# EAGLE design untitled 6 (EAGLE 7.5.0)
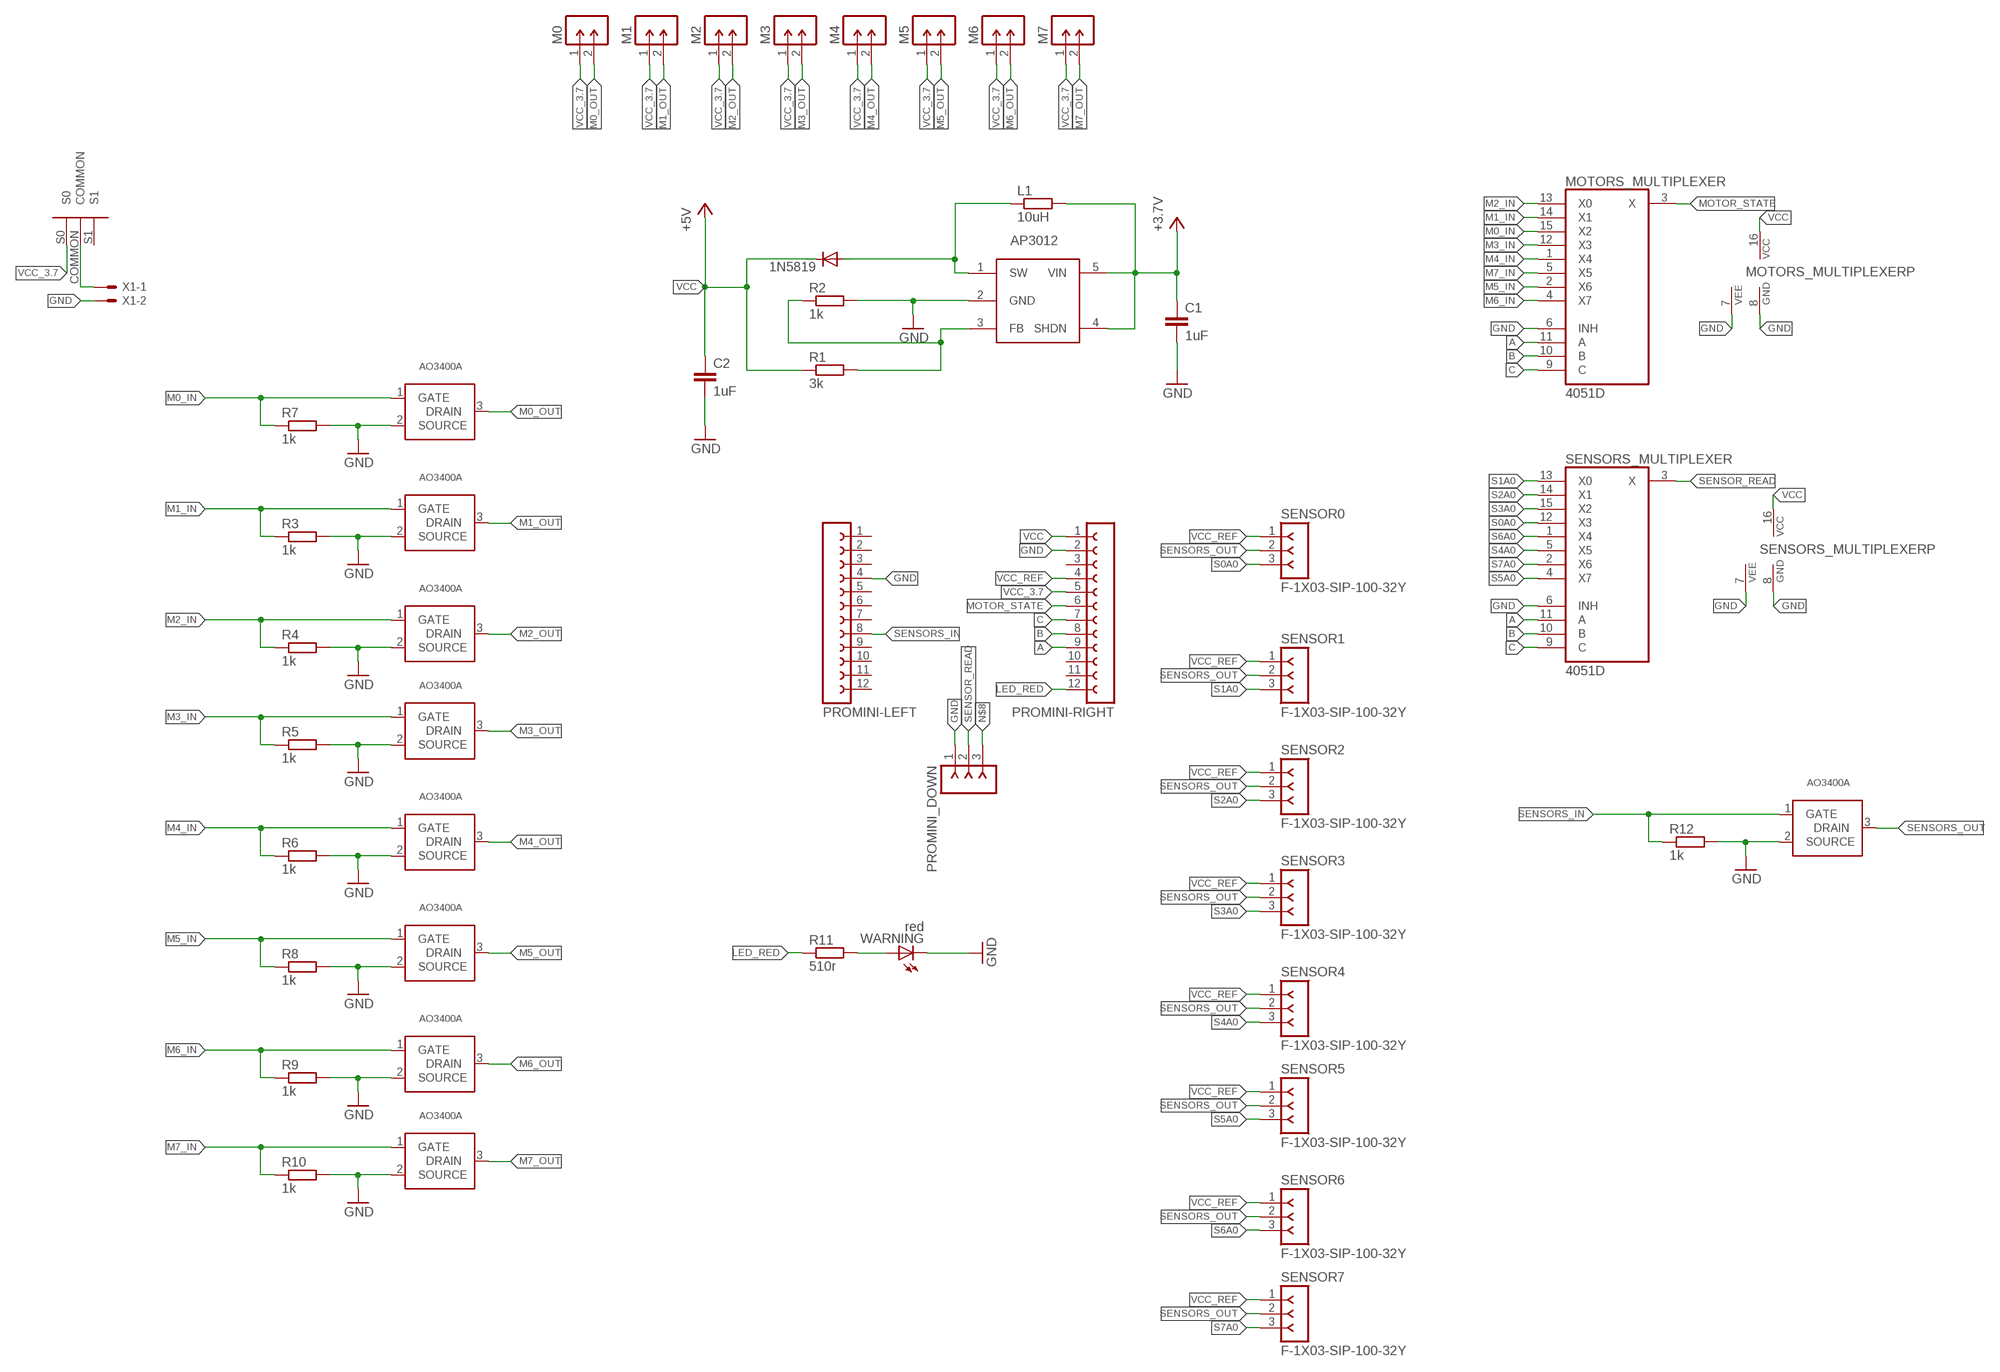
[diagram p0: schematic, sheet 1]

## Parts
1N5819  DIODE-DO214AC  [DO214AC]
C1  1uF  C-EUC1206  [C1206]
C2  1uF  C-EUC1206  [C1206]
L1  10uH  R-EU_R0805  [R0805]
M0  M-1X02-SIP-100-32Y  [SIP-100-02-32Y]
M1  M-1X02-SIP-100-32Y  [SIP-100-02-32Y]
M2  M-1X02-SIP-100-32Y  [SIP-100-02-32Y]
M3  M-1X02-SIP-100-32Y  [SIP-100-02-32Y]
M4  M-1X02-SIP-100-32Y  [SIP-100-02-32Y]
M5  M-1X02-SIP-100-32Y  [SIP-100-02-32Y]
M6  M-1X02-SIP-100-32Y  [SIP-100-02-32Y]
M7  M-1X02-SIP-100-32Y  [SIP-100-02-32Y]
MOSFET0  AO3400A  [SOT-23]
MOSFET1  AO3400A  [SOT-23]
MOSFET2  AO3400A  [SOT-23]
MOSFET3  AO3400A  [SOT-23]
MOSFET4  AO3400A  [SOT-23]
MOSFET5  AO3400A  [SOT-23]
MOSFET6  AO3400A  [SOT-23]
MOSFET7  AO3400A  [SOT-23]
MOSFET8  AO3400A  [SOT-23]
MOTORS_MULTIPLEXER  4051D  [SO16]
PROMINI-LEFT  FE12-1  [FE12]
PROMINI-RIGHT  FE12-1  [FE12]
PROMINI_DOWN  F-1X03-SIP-100-32Y  [SIP-100-03-32Y]
R1  3k  R-EU_R1206  [R1206]
R2  1k  R-EU_R1206  [R1206]
R3  1k  R-EU_R1206  [R1206]
R4  1k  R-EU_R1206  [R1206]
R5  1k  R-EU_R1206  [R1206]
R6  1k  R-EU_R1206  [R1206]
R7  1k  R-EU_R1206  [R1206]
R8  1k  R-EU_R1206  [R1206]
R9  1k  R-EU_R1206  [R1206]
R10  1k  R-EU_R1206  [R1206]
R11  510r  R-EU_M0805  [M0805]
R12  1k  R-EU_R1206  [R1206]
SENSOR0  F-1X03-SIP-100-32Y  [SIP-100-03-32Y]
SENSOR1  F-1X03-SIP-100-32Y  [SIP-100-03-32Y]
SENSOR2  F-1X03-SIP-100-32Y  [SIP-100-03-32Y]
SENSOR3  F-1X03-SIP-100-32Y  [SIP-100-03-32Y]
SENSOR4  F-1X03-SIP-100-32Y  [SIP-100-03-32Y]
SENSOR5  F-1X03-SIP-100-32Y  [SIP-100-03-32Y]
SENSOR6  F-1X03-SIP-100-32Y  [SIP-100-03-32Y]
SENSOR7  F-1X03-SIP-100-32Y  [SIP-100-03-32Y]
SENSORS_MULTIPLEXER  4051D  [SO16]
U$1  AP3012  [SOT-23-5]
U$2  SPDT_SLIDE_SWITCH_2_PITCH  [SPDT_SLIDE_SWITCH_2_PITCH]
WARNING  red  LEDCHIP-LED0805  [CHIP-LED0805]
X1  JST-XH-02-PIN-LONG-PAD  [JST-XH-02-PACKAGE-LONG-PAD]

## Nets
A: MOTORS_MULTIPLEXER.11(A) PROMINI-RIGHT.9 SENSORS_MULTIPLEXER.11(A)
B: MOTORS_MULTIPLEXER.10(B) PROMINI-RIGHT.8 SENSORS_MULTIPLEXER.10(B)
C: MOTORS_MULTIPLEXER.9(C) PROMINI-RIGHT.7 SENSORS_MULTIPLEXER.9(C)
GND: C1.2 C2.2 MOSFET0.2(SOURCE) MOSFET1.2(SOURCE) MOSFET2.2(SOURCE) MOSFET3.2(SOURCE) MOSFET4.2(SOURCE) MOSFET5.2(SOURCE) MOSFET6.2(SOURCE) MOSFET7.2(SOURCE) MOSFET8.2(SOURCE) MOTORS_MULTIPLEXER.6(INH) MOTORS_MULTIPLEXER.7(VEE) MOTORS_MULTIPLEXER.8(GND) PROMINI-LEFT.4 PROMINI-RIGHT.2 PROMINI_DOWN.1 R2.2 R3.2 R4.2 R5.2 R6.2 R7.2 R8.2 R9.2 R10.2 R12.2 SENSORS_MULTIPLEXER.6(INH) SENSORS_MULTIPLEXER.7(VEE) SENSORS_MULTIPLEXER.8(GND) U$1.2(GND) WARNING.C X1.2
LED_RED: PROMINI-RIGHT.12 R11.1
M0_IN: MOSFET0.1(GATE) MOTORS_MULTIPLEXER.15(X2) R7.1
M0_OUT: M0.2 MOSFET0.3(DRAIN)
M1_IN: MOSFET1.1(GATE) MOTORS_MULTIPLEXER.14(X1) R3.1
M1_OUT: M1.2 MOSFET1.3(DRAIN)
M2_IN: MOSFET2.1(GATE) MOTORS_MULTIPLEXER.13(X0) R4.1
M2_OUT: M2.2 MOSFET2.3(DRAIN)
M3_IN: MOSFET3.1(GATE) MOTORS_MULTIPLEXER.12(X3) R5.1
M3_OUT: M3.2 MOSFET3.3(DRAIN)
M4_IN: MOSFET4.1(GATE) MOTORS_MULTIPLEXER.1(X4) R6.1
M4_OUT: M4.2 MOSFET4.3(DRAIN)
M5_IN: MOSFET5.1(GATE) MOTORS_MULTIPLEXER.2(X6) R8.1
M5_OUT: M5.2 MOSFET5.3(DRAIN)
M6_IN: MOSFET6.1(GATE) MOTORS_MULTIPLEXER.4(X7) R9.1
M6_OUT: M6.2 MOSFET6.3(DRAIN)
M7_IN: MOSFET7.1(GATE) MOTORS_MULTIPLEXER.5(X5) R10.1
M7_OUT: M7.2 MOSFET7.3(DRAIN)
MOTOR_STATE: MOTORS_MULTIPLEXER.3(X) PROMINI-RIGHT.6
N$1: 1N5819.A L1.1 U$1.1(SW)
N$3: R1.2 R2.1 U$1.3(FB)
N$4: R11.2 WARNING.A
N$5: U$2.COMMON X1.1
N$8: PROMINI_DOWN.3
S0A0: SENSOR0.3 SENSORS_MULTIPLEXER.12(X3)
S1A0: SENSOR1.3 SENSORS_MULTIPLEXER.13(X0)
S2A0: SENSOR2.3 SENSORS_MULTIPLEXER.14(X1)
S3A0: SENSOR3.3 SENSORS_MULTIPLEXER.15(X2)
S4A0: SENSOR4.3 SENSORS_MULTIPLEXER.5(X5)
S5A0: SENSOR5.3 SENSORS_MULTIPLEXER.4(X7)
S6A0: SENSOR6.3 SENSORS_MULTIPLEXER.1(X4)
S7A0: SENSOR7.3 SENSORS_MULTIPLEXER.2(X6)
SENSOR_READ: PROMINI_DOWN.2 SENSORS_MULTIPLEXER.3(X)
SENSORS_IN: MOSFET8.1(GATE) PROMINI-LEFT.8 R12.1
SENSORS_OUT: MOSFET8.3(DRAIN) SENSOR0.2 SENSOR1.2 SENSOR2.2 SENSOR3.2 SENSOR4.2 SENSOR5.2 SENSOR6.2 SENSOR7.2
VCC: 1N5819.C C2.1 MOTORS_MULTIPLEXER.16(VCC) PROMINI-RIGHT.1 R1.1 SENSORS_MULTIPLEXER.16(VCC) ; supply symbol labelled +5V
VCC_3.7: C1.1 L1.2 M0.1 M1.1 M2.1 M3.1 M4.1 M5.1 M6.1 M7.1 PROMINI-RIGHT.5 U$1.4(SHDN) U$1.5(VIN) U$2.S0 ; supply symbol labelled +3.7V
VCC_REF: PROMINI-RIGHT.4 SENSOR0.1 SENSOR1.1 SENSOR2.1 SENSOR3.1 SENSOR4.1 SENSOR5.1 SENSOR6.1 SENSOR7.1
Unconnected: PROMINI-LEFT.1 PROMINI-LEFT.2 PROMINI-LEFT.3 PROMINI-LEFT.5 PROMINI-LEFT.6 PROMINI-LEFT.7 PROMINI-LEFT.9 PROMINI-LEFT.10 PROMINI-LEFT.11 PROMINI-LEFT.12 PROMINI-RIGHT.3 PROMINI-RIGHT.10 PROMINI-RIGHT.11 U$2.S1

## Library data of the parts
1N5819 = diode:DIODE-: DIODE
C1 C2 = resistor:C-EU: CAPACITOR, European symbol
L1 R1-R12 = resistor:R-EU_: RESISTOR, European symbol
M0 M1-M7 = con-headers-jp:M-1X02-: MALE HEADER
MOSFET0 MOSFET1-MOSFET8 = smd-footprints:AO3400A
MOTORS_MULTIPLEXER SENSORS_MULTIPLEXER = 40xx:4051: 8-channel ANALOG MULTIPLEXER
PROMINI-LEFT PROMINI-RIGHT = con-lsta:FE12-1: FEMALE HEADER; OC_FARNELL: unknown; OC_NEWARK: unknown
PROMINI_DOWN SENSOR0 SENSOR1-SENSOR7 = con-headers-jp:F-1X03-: FEMALE HEADER
U$1 = smd-footprints:AP3012
U$2 = sh4dov lib:SPDT_SLIDE_SWITCH_2_PITCH
WARNING = led:LED: LED OSRAM: - CHIPLED LG R971, LG N971, LY N971, LG Q971, LY Q971, LO R971, LY R971 LH N974, LH R974 LS Q976, LO Q976, LY Q976 LO Q996 - Hyper CHIPLED LW Q18S LB Q993, LB Q99A, LB R99A - SideLED LS A670, LO A670, LY A670, LG A670, LP A670 LB A673, LV A673, LT A673, LW A673 LH A674 LY A675 LS A676, LA A676, LO A676, LY A676, LW A676 LS A679, LY A679, LG A679 - Hyper Micro SIDELED® LS Y876, LA Y876, LO Y876, LY Y876 LT Y87S - SmartLED LW L88C, LW L88S LB L89C, LB L89S, LG L890 LS L89K, LO L89K, LY L89K LS L896, LA L896, LO L896, LY L896 - TOPLED LS T670, LO T670, LY T670, LG T670, LP T670 LSG T670, LSP T670, LSY T670, LOP T670, LYG T670 LG T671, LOG T671, LSG T671 LB T673, LV T673, LT T673, LW T673 LH T674 LS T676, LA T676, LO T676, LY T676, LB T676, LH T676, LSB T676, LW T676 LB T67C, LV T67C, LT T67C, LS T67K, LO T67K, LY T67K, LW E67C LS E67B, LA E67B, LO E67B, LY E67B, LB E67C, LV E67C, LT E67C LW T67C LS T679, LY T679, LG T679 LS T770, LO T770, LY T770, LG T770, LP T770 LB T773, LV T773, LT T773, LW T773 LH T774 LS E675, LA E675, LY E675, LS T675 LS T776, LA T776, LO T776, LY T776, LB T776 LHGB T686 LT T68C, LB T68C - Hyper Mini TOPLED® LB M676 - Mini TOPLED Santana® LG M470 LS M47K, LO M47K, LY M47K Source: http://www.osram.convergy.de LUXEON: - LUMILED® LXK2-PW12-R00, LXK2-PW12-S00, LXK2-PW14-U00, LXK2-PW14-V00 LXK2-PM12-R00, LXK2-PM12-S00, LXK2-PM14-U00 LXK2-PE12-Q00, LXK2-PE12-R00, LXK2-PE12-S00, LXK2-PE14-T00, LXK2-PE14-U00 LXK2-PB12-K00, LXK2-PB12-L00, LXK2-PB12-M00, LXK2-PB14-N00, LXK2-PB14-P00, LXK2-PB14-Q00 LXK2-PR12-L00, LXK2-PR12-M00, LXK2-PR14-Q00, LXK2-PR14-R00 LXK2-PD12-Q00, LXK2-PD12-R00, LXK2-PD12-S00 LXK2-PH12-R00, LXK2-PH12-S00 LXK2-PL12-P00, LXK2-PL12-Q00, LXK2-PL12-R00 Source: www.luxeon.com KINGBRIGHT: KA-3528ASYC Source: www.kingbright.com
X1 = Rembrandt Electronics - JST XH Connectors v1-0:JST-XH-02-PIN: JST XH Connector 2 Pin Wire to board connector. Pitch: 2,54 mm, (0.100") Number of pins: 2 Created by Rembrandt Electronics www.rembrandtelectronics.com

## Board
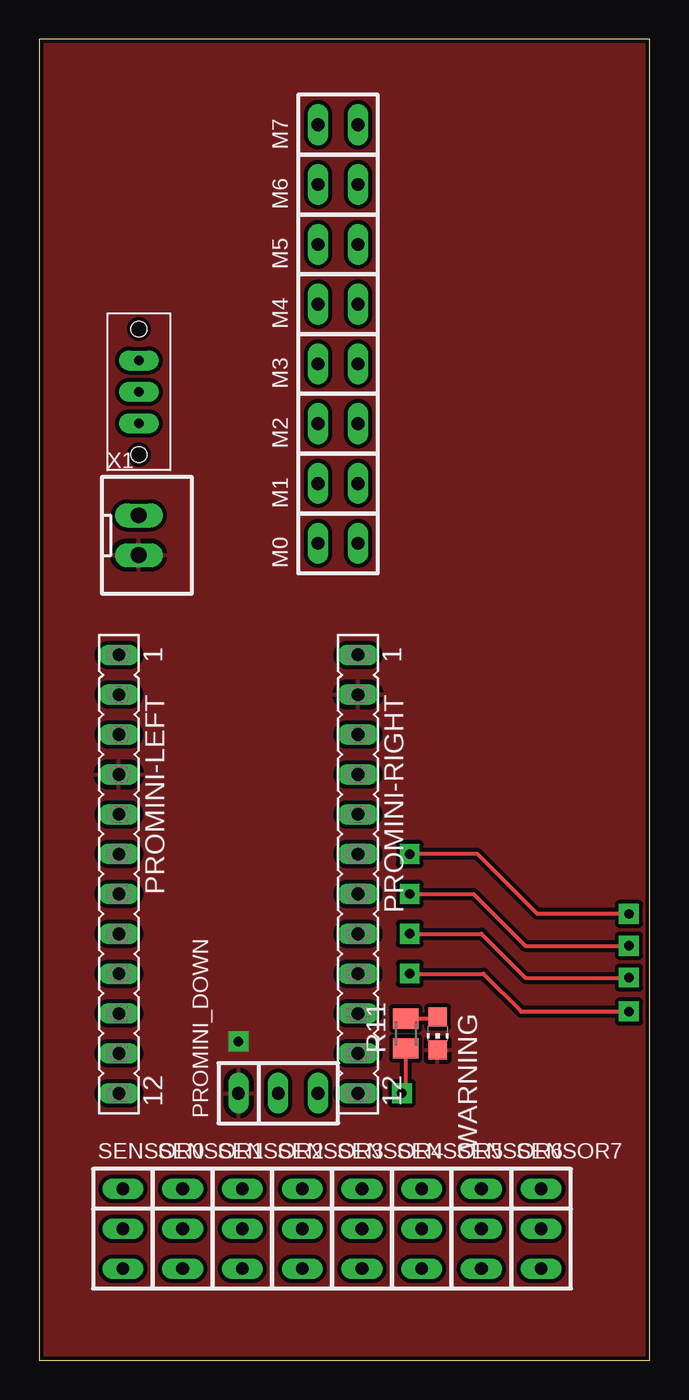
[diagram p1: board, top side]
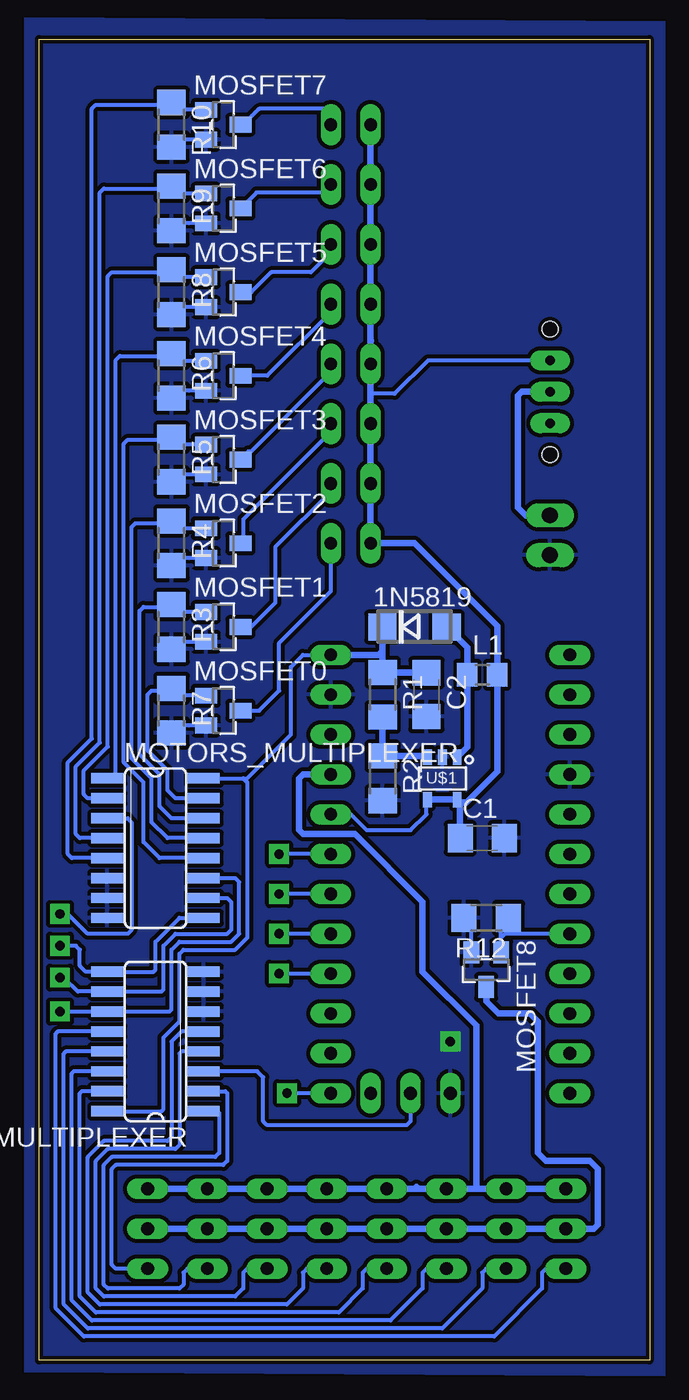
[diagram p2: board, bottom side, seen from below]

Size 38.91 x 84.19 mm. Coordinates in mm from the lower left corner, seen from the top.
Outline: 0,0 38.91,0 38.91,84.19 0,84.19 0,0
Copper layers (1*16): Top 0.035mm / dielectric 1.5mm / Bottom 0.035mm
Design rules "default 10mils": minimum track width 10mil, minimum drill 24mil, track to track 10mil, track to pad 10mil, pad to pad 10mil, via to via 10mil, smd to smd 10mil, copper to edge 10mil, drill to drill 10mil, minimum pad ring 10mil, minimum via ring 8mil, stop-mask expansion 4mil, vias tented up to drill 0mil, thermal gap 12mil

### Footprints (pad centres in the part's own frame; a part is rotated, then mirrored left to right if it is on the bottom)
DO214AC = smd 1.8 x 1.7: A 2.05,0; C -2.05,0
C1206 = smd 1.6 x 1.8: 1 -1.4,0; 2 1.4,0
R0805 = smd 1.3 x 1.5: 1 -0.95,0; 2 0.95,0
SIP-100-02-32Y = drill 0.813 long: 1 -1.27,0; 2 1.27,0
SOT-23 = smd 1 x 1.4: 1 -0.95,-1.1; 2 0.95,-1.1; 3 0,1.1
SO16 = smd 0.66 x 2.032: 1 -4.445,-3.073; 2 -3.175,-3.073; 3 -1.905,-3.073; 4 -0.635,-3.073; 5 0.635,-3.073; 6 1.905,-3.073; 7 3.175,-3.073; 8 4.445,-3.073; 9 4.445,3.073; 10 3.175,3.073; 11 1.905,3.073; 12 0.635,3.073; 13 -0.635,3.073; 14 -1.905,3.073; 15 -3.175,3.073; 16 -4.445,3.073
FE12 = drill 0.813 long: 1 -13.97,0; 2 -11.43,0; 3 -8.89,0; 4 -6.35,0; 5 -3.81,0; 6 -1.27,0; 7 1.27,0; 8 3.81,0; 9 6.35,0; 10 8.89,0; 11 11.43,0; 12 13.97,0
SIP-100-03-32Y = drill 0.813 long: 1 -2.54,0; 2 0,0; 3 2.54,0
R1206 = smd 1.6 x 1.803: 1 -1.422,0; 2 1.422,0
M0805 = smd 1.3 x 1.6: 1 -0.95,0; 2 0.95,0
SOT-23-5 = smd 1 x 0.55: 1 -1.35,0.95; 2 -1.35,0; 3 -1.35,-0.95; 4 1.35,-0.95; 5 1.35,0.95
SPDT_SLIDE_SWITCH_2_PITCH = drill 0.6 pad 1.27 long: COMMON 0,0; S0 -2,0; S1 2,0 | hole 1: -4,0; 4,0
CHIP-LED0805 = smd 1.2 x 1.2: A 0,-1.05; C 0,1.05
JST-XH-02-PACKAGE-LONG-PAD = drill 1.016 long: 1 -1.27,0; 2 1.27,0

### Placement (x,y rotation side)
1N5819  14.99,46.74 0 bottom
C1  10.67,33.27 0 bottom
C2  14.22,42.42 270 bottom
L1  10.67,43.69 0 bottom
M0  19.05,52.07 0 top
M1  19.05,55.88 0 top
M2  19.05,59.69 0 top
M3  19.05,63.5 0 top
M4  19.05,67.31 0 top
M5  19.05,71.12 0 top
M6  19.05,74.93 0 top
M7  19.05,78.74 0 top
MOSFET0  27.18,41.4 270 bottom
MOSFET1  27.18,46.74 270 bottom
MOSFET2  27.18,52.07 270 bottom
MOSFET3  27.18,57.4 270 bottom
MOSFET4  27.18,62.74 270 bottom
MOSFET5  27.18,68.07 270 bottom
MOSFET6  27.18,73.41 270 bottom
MOSFET7  27.18,78.74 270 bottom
MOSFET8  10.41,24.89 180 bottom
MOTORS_MULTIPLEXER  31.5,32.64 270 bottom
PROMINI-LEFT  5.08,30.99 270 top
PROMINI-RIGHT  20.32,30.99 270 top
PROMINI_DOWN  15.24,17.02 0 top
R1  17.02,42.42 270 bottom
R2  17.02,37.08 270 bottom
R3  30.48,46.74 270 bottom
R4  30.48,52.07 270 bottom
R5  30.48,57.4 270 bottom
R6  30.48,62.74 270 bottom
R7  30.48,41.4 270 bottom
R8  30.48,68.07 270 bottom
R9  30.48,73.41 270 bottom
R10  30.48,78.74 270 bottom
R11  23.37,20.83 90 top
R12  10.41,28.19 180 bottom
SENSOR0  5.33,8.38 270 top
SENSOR1  9.14,8.38 270 top
SENSOR2  12.95,8.38 270 top
SENSOR3  16.76,8.38 270 top
SENSOR4  20.57,8.38 270 top
SENSOR5  24.38,8.38 270 top
SENSOR6  28.19,8.38 270 top
SENSOR7  32,8.38 270 top
SENSORS_MULTIPLEXER  31.5,20.32 90 bottom
U$1  13.21,37.08 270 bottom
U$2  6.35,61.72 270 top
WARNING  25.4,20.83 180 top
X1  6.35,52.58 270 top

### Tracks (layer width: path | path; a pad name or v marks a point on that pad's centre or on a via)
A  (via drill 0.6 pad 1.27)
  Top 0.254: v23.62,24.64 28.32,24.64 30.73,22.23 v37.59,22.23
  Bottom 0.254: MOTORS_MULTIPLEXER.11 26.42,30.73 26.16,30.48 26.16,27.18 26.67,26.67 29.97,26.67 30.48,26.16 30.48,22.35 30.61,22.23 SENSORS_MULTIPLEXER.11 v37.59,22.23 | PROMINI-RIGHT.9 v23.62,24.64
B  (via drill 0.6 pad 1.27)
  Top 0.254: v23.62,27.18 28.19,27.18 30.99,24.38 v37.59,24.38
  Bottom 0.254: MOTORS_MULTIPLEXER.10 26.92,29.46 26.67,29.21 26.67,27.43 26.92,27.18 30.23,27.18 30.99,26.42 30.99,23.62 31.11,23.5 SENSORS_MULTIPLEXER.10 36.45,23.5 37.34,24.38 v37.59,24.38 | PROMINI-RIGHT.8 v23.62,27.18
C  (via drill 0.6 pad 1.27)
  Top 0.254: v23.62,29.72 27.69,29.72 30.99,26.42 v37.59,26.42
  Bottom 0.254: MOTORS_MULTIPLEXER.9 29.97,28.19 31.5,26.67 31.5,24.89 31.62,24.77 SENSORS_MULTIPLEXER.9 35.94,24.77 36.32,25.15 36.32,26.16 36.58,26.42 v37.59,26.42 37.08,26.42 | PROMINI-RIGHT.7 v23.62,29.72
GND  (via drill 0.6 pad 1.27)
  Bottom 0.254: MOSFET0.2 30.01,40.45 R7.2 | 30.26,45.53 R3.2 30.01,45.79 MOSFET1.2 | MOSFET2.2 30.01,51.12 R4.2 | MOSFET3.2 30.01,56.45 R5.2 | MOSFET4.2 30.01,61.79 R6.2 | MOSFET5.2 30.01,67.12 R8.2 | MOSFET6.2 30.01,72.46 R9.2 | MOSFET7.2 30.01,77.79 R10.2 | MOSFET8.2 11.36,27.72 R12.2
  other vias: 12.7,20.32
  pour Bottom: 0,84.33 38.86,84.84 38.86,0.51 0,0
  pour Top: 0,0 38.86,0 38.86,84.07 0,84.07
LED_RED  (via drill 0.6 pad 1.27)
  Top 0.254: v23.11,17.02 23.37,17.27 R11.1
  Bottom 0.254: PROMINI-RIGHT.12 v23.11,17.02
M0_IN
  Bottom 0.254: MOSFET0.1 30.01,42.35 R7.1 30.63,42.67 31.75,42.67 32,42.42 32,38.86 30.73,37.59 30.73,36.32 30.23,35.81 MOTORS_MULTIPLEXER.15
M0_OUT
  Bottom 0.254: MOSFET0.3 24.89,41.4 23.62,42.67 23.62,45.72 20.32,49.02 M0.2
M1_IN
  Bottom 0.254: MOTORS_MULTIPLEXER.14 30.48,34.54 31.24,35.31 31.24,37.34 32.51,38.61 32.51,47.75 32.26,48.01 30.63,48.01 R3.1 30.01,47.69 MOSFET1.1
M1_OUT
  Bottom 0.254: M1.2 20.32,55.37 23.88,51.82 23.88,48.26 25.4,46.74 MOSFET1.3
M2_IN
  Bottom 0.254: MOSFET2.1 30.01,53.02 R4.1 30.63,53.34 32.77,53.34 33.02,53.09 33.02,38.35 31.75,37.08 31.75,34.29 30.73,33.27 MOTORS_MULTIPLEXER.13
M2_OUT
  Bottom 0.254: M2.2 20.32,59.18 25.91,53.59 25.91,52.24 MOSFET2.3
M3_IN
  Bottom 0.254: MOTORS_MULTIPLEXER.12 31.24,32 32.26,33.02 32.26,36.83 33.53,38.1 33.53,58.42 33.27,58.67 30.63,58.67 R5.1 30.01,58.35 MOSFET3.1
M3_OUT
  Bottom 0.254: M3.2 20.32,62.99 25.4,57.91 25.57,57.91 MOSFET3.3
M4_IN
  Bottom 0.254: MOTORS_MULTIPLEXER.1 34.29,37.08 34.04,37.34 34.04,63.75 33.78,64.01 30.99,64.01 | 30.99,64.01 30.63,64.01 R6.1 | MOSFET4.1 30.67,63.69 30.99,64.01
M4_OUT
  Bottom 0.254: 25.91,62.74 MOSFET4.3 24.38,62.74 20.32,66.8 M4.2
M5_IN
  Bottom 0.254: MOTORS_MULTIPLEXER.2 35.81,35.81 36.07,36.07 36.07,37.59 34.54,39.12 34.54,69.09 34.29,69.34 30.63,69.34 R8.1 30.01,69.02 MOSFET5.1
M5_OUT
  Bottom 0.254: 25.91,68.07 MOSFET5.3 25.4,68.07 24.13,69.34 21.59,69.34 20.32,70.61 M5.2
M6_IN
  Bottom 0.254: MOTORS_MULTIPLEXER.4 36.32,33.27 36.58,33.53 36.58,37.85 35.05,39.37 35.05,74.42 34.8,74.68 30.63,74.68 R9.1 30.01,74.36 MOSFET6.1
M6_OUT
  Bottom 0.254: M6.2 20.32,74.42 25.06,74.42 MOSFET6.3
M7_IN
  Bottom 0.254: MOTORS_MULTIPLEXER.5 36.83,32 37.08,32.26 37.08,38.1 35.56,39.62 35.56,79.76 35.31,80.01 30.63,80.01 R10.1 30.01,79.69 MOSFET7.1
M7_OUT
  Bottom 0.254: M7.2 20.32,79.5 20.57,79.76 24.89,79.76 25.65,78.99 25.82,78.99 MOSFET7.3
MOTOR_STATE  (via drill 0.6 pad 1.27)
  Top 0.254: 23.88,32.26 v23.62,32.26 27.94,32.26 31.75,28.45 v37.59,28.45
  Bottom 0.254: PROMINI-RIGHT.6 v23.62,32.26 | MOTORS_MULTIPLEXER.3 33.27,34.54 33.02,34.29 33.02,27.43 33.27,27.18 35.81,27.18 37.08,28.45 v37.59,28.45
N$1
  Bottom 0.406: 1N5819.A 11.62,45.42 L1.1 11.62,39.07 U$1.1
N$2
  pour Bottom: -1.02,85.34 39.88,85.6 39.88,-0.76 -1.02,-1.02
N$3
  Bottom 0.406: R1.2 R2.1 14.23,38.51 U$1.3
N$4
  Top 0.254: R11.2 25.3,21.78 WARNING.A
N$5
  Bottom 0.406: X1.1 7.87,53.85 8.38,54.36 8.38,61.47 8.13,61.72 U$2.COMMON
S0A0
  Bottom 0.254: SENSOR0.3 6.6,5.84 6.86,5.59 6.86,4.57 9.91,1.52 36.07,1.52 37.85,3.3 37.85,20.83 37.72,20.96 SENSORS_MULTIPLEXER.12
S1A0
  Bottom 0.254: SENSOR1.3 10.41,5.84 10.67,5.59 10.67,4.57 13.21,2.03 35.81,2.03 37.34,3.56 37.34,19.56 37.21,19.69 SENSORS_MULTIPLEXER.13
S2A0
  Bottom 0.254: SENSOR2.3 14.22,5.84 14.48,5.59 14.48,4.57 16.51,2.54 35.56,2.54 36.83,3.81 36.83,18.29 36.7,18.42 SENSORS_MULTIPLEXER.14
S3A0
  Bottom 0.254: SENSOR3.3 18.03,5.84 18.29,5.59 18.29,4.57 19.81,3.05 35.31,3.05 36.32,4.06 36.32,17.02 36.19,17.14 SENSORS_MULTIPLEXER.15
S4A0
  Bottom 0.254: SENSOR4.3 21.84,5.84 22.1,5.59 22.1,4.57 23.11,3.56 35.05,3.56 35.81,4.32 35.81,12.95 34.8,13.97 30.73,13.97 30.48,14.22 30.48,20.32 29.85,20.96 SENSORS_MULTIPLEXER.5
S5A0
  Bottom 0.254: SENSOR5.3 25.65,5.84 25.91,5.59 25.91,4.57 26.42,4.06 34.8,4.06 35.31,4.57 35.31,12.7 34.54,13.46 30.23,13.46 29.97,13.72 29.97,19.56 29.85,19.69 SENSORS_MULTIPLEXER.4
S6A0
  Bottom 0.254: SENSOR6.3 29.46,5.84 29.72,5.59 29.72,4.83 29.97,4.57 34.54,4.57 34.8,4.83 34.8,12.45 34.29,12.95 27.69,12.95 27.43,13.21 27.43,15.75 27.56,15.88 SENSORS_MULTIPLEXER.1
S7A0
  Bottom 0.254: SENSOR7.3 34.04,5.84 34.29,6.1 34.29,12.19 34.04,12.45 27.18,12.45 26.92,12.7 26.92,17.02 27.05,17.14 SENSORS_MULTIPLEXER.2
SENSOR_READ
  Bottom 0.254: PROMINI_DOWN.2 15.24,15.24 15.49,14.99 24.38,14.99 24.64,15.24 24.64,18.03 25.02,18.42 SENSORS_MULTIPLEXER.3
SENSORS_IN
  Bottom 0.254: MOSFET8.1 9.46,26.92 | 9.46,26.92 9.46,27.72 R12.1 | PROMINI-LEFT.8 9.21,27.18 9.46,26.92
SENSORS_OUT
  Bottom 0.406: SENSOR7.2 SENSOR6.2 SENSOR5.2 SENSOR4.2 SENSOR3.2 SENSOR2.2 SENSOR1.2 SENSOR0.2 3.56,8.38 3.3,8.64 3.3,12.19 3.81,12.7 6.6,12.7 7.11,13.21 7.11,21.59 7.62,22.1 9.65,22.1 10.41,22.86 MOSFET8.3
VCC
  Bottom 0.254: SENSORS_MULTIPLEXER.16 31.11,15.88 30.99,16 30.99,20.57 29.97,21.59 29.97,25.91 29.72,26.16 26.42,26.16 25.65,26.92 25.65,36.83 25.91,37.08 | MOTORS_MULTIPLEXER.16 25.91,37.08 | 25.91,37.08 25.65,37.08 22.86,39.88 22.86,44.2 22.1,44.96 PROMINI-RIGHT.1
  Bottom 0.406: 17.02,45.21 R1.1 14.25,43.84 C2.1 | 17.02,45.21 17.02,46.72 1N5819.C | PROMINI-RIGHT.1 17.27,44.96 17.02,45.21
VCC_3.7
  Bottom 0.254: PROMINI-RIGHT.5 19.05,34.8 18.03,33.78 15.24,33.78 14.22,34.8 14.22,35.67 U$1.4 | U$2.S0 14.13,63.72 16.26,61.59 17.65,61.59 17.78,61.47
  Bottom 0.406: M7.1 M6.1 M5.1 M4.1 17.78,65.02 | 17.78,65.02 M3.1 17.78,61.47 M2.1 M1.1 M0.1 14.99,52.07 9.72,46.8 L1.2 9.72,37.53 11.68,35.56 12.08,35.56 | 17.75,64.99 17.78,65.02 | 12.08,35.56 U$1.5 U$1.4 | 12.08,35.56 12.08,33.29 C1.1
VCC_REF
  Bottom 0.406: SENSOR7.1 SENSOR6.1 SENSOR5.1 SENSOR4.1 SENSOR3.1 14.99,10.92 | 14.99,10.92 SENSOR2.1 11.18,10.92 | 11.18,10.92 SENSOR1.1 SENSOR0.1 | PROMINI-RIGHT.4 22.1,37.34 22.35,37.08 22.35,33.78 22.1,33.53 18.8,33.53 14.48,29.21 14.48,24.77 11.05,21.34 11.05,11.05 11.18,10.92 | 14.86,11.05 14.99,10.92